# EAGLE design Buffer_Board (EAGLE 5.10)
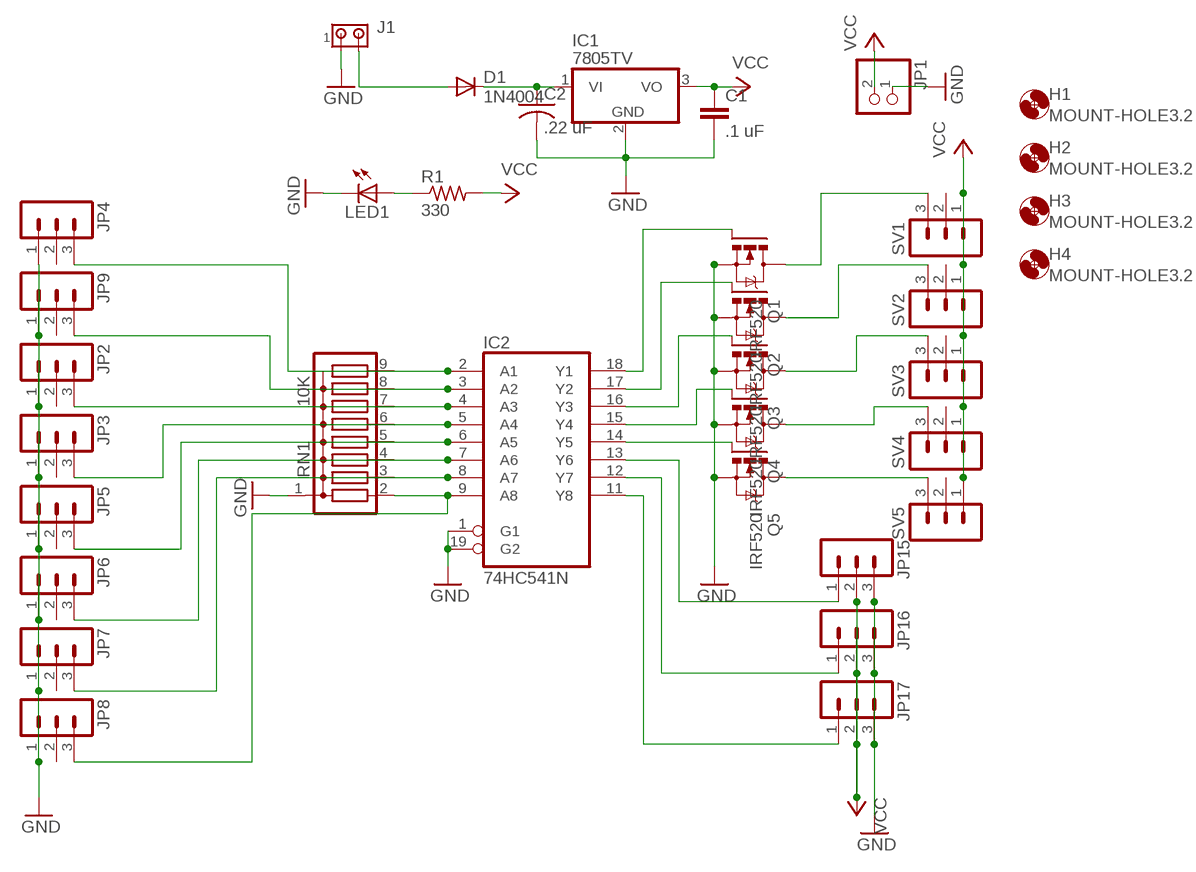
[diagram p0: schematic, sheet 1]

## Parts
C1  .1 uF  C2.5/2  [C2.5-2]
C2  .22 uF  C-US050-030X075  [C050-030X075]
D1  1N4004  [DO41-10]
H1  MOUNT-HOLE3.2  [3,2]
H2  MOUNT-HOLE3.2  [3,2]
H3  MOUNT-HOLE3.2  [3,2]
H4  MOUNT-HOLE3.2  [3,2]
IC1  7805TV  [TO220V]
IC2  74HC541N  [DIL20]
J1  MTA02-156  [1X2MTA]
JP1  PINHD-1X2  [1X02]
JP2  MA03-1  [MA03-1]
JP3  MA03-1  [MA03-1]
JP4  MA03-1  [MA03-1]
JP5  MA03-1  [MA03-1]
JP6  MA03-1  [MA03-1]
JP7  MA03-1  [MA03-1]
JP8  MA03-1  [MA03-1]
JP9  MA03-1  [MA03-1]
JP15  MA03-1  [MA03-1]
JP16  MA03-1  [MA03-1]
JP17  MA03-1  [MA03-1]
LED1  LED3MM  [LED3MM]
Q1  IRF520  [TO220BV]
Q2  IRF520  [TO220BV]
Q3  IRF520  [TO220BV]
Q4  IRF520  [TO220BV]
Q5  IRF520  [TO220BV]
R1  330  R-US_0207/10  [0207/10]
RN1  10K  G08R  [SIL9]
SV1  MA03-1  [MA03-1]
SV2  MA03-1  [MA03-1]
SV3  MA03-1  [MA03-1]
SV4  MA03-1  [MA03-1]
SV5  MA03-1  [MA03-1]

## Nets
GND: C1.2 C2.2 IC1.2(GND) IC2.1(G1) IC2.19(G2) J1.1 JP1.1 JP2.1 JP3.1 JP4.1 JP5.1 JP6.1 JP7.1 JP8.1 JP9.1 JP15.3 JP16.3 JP17.3 LED1.K(C) Q1.S Q2.S Q3.S Q4.S Q5.S RN1.1
N$1: C2.1 D1.C IC1.1(VI)
N$2: LED1.A R1.1
N$3: D1.A J1.2
N$4: IC2.13(Y6) JP15.1
N$5: Q5.D SV5.3
N$6: IC2.12(Y7) JP16.1
N$8: IC2.14(Y5) Q5.G
N$10: IC2.11(Y8) JP17.1
N$11: IC2.6(A5) JP5.3 RN1.5
N$12: IC2.7(A6) JP6.3 RN1.4
N$13: IC2.8(A7) JP7.3 RN1.3
N$14: IC2.9(A8) JP8.3 RN1.2
N$15: IC2.3(A2) JP9.3 RN1.8
N$16: IC2.2(A1) JP4.3 RN1.9
N$18: IC2.18(Y1) Q1.G
N$19: IC2.17(Y2) Q2.G
N$20: IC2.16(Y3) Q3.G
N$21: IC2.15(Y4) Q4.G
N$24: IC2.4(A3) JP2.3 RN1.7
N$26: Q1.D SV1.3
N$29: Q2.D SV2.3
N$30: Q3.D SV3.3
N$31: Q4.D SV4.3
N$32: IC2.5(A4) JP3.3 RN1.6
VCC: C1.1 IC1.3(VO) JP1.2 JP15.2 JP16.2 JP17.2 R1.2 SV1.1 SV2.1 SV3.1 SV4.1 SV5.1
Unconnected: JP2.2 JP3.2 JP4.2 JP5.2 JP6.2 JP7.2 JP8.2 JP9.2 SV1.2 SV2.2 SV3.2 SV4.2 SV5.2

## Power pins joined to a net without a drawn wire
GND: IC2.10(GND)
VCC: IC2.20(VCC)

## Library data of the parts
C1 = capacitor-wima:C: CAPACITOR naming: grid - package width
C2 = rcl:C-US: CAPACITOR, American symbol
D1 = diode:1N4004: DIODE general purpose rectifier, 1 A
H1-H4 = holes:MOUNT-HOLE: MOUNTING HOLE with drill center marker
IC1 = linear:78*: Positive VOLTAGE REGULATOR Source: http://cache.national.com/ds/LM/LM78L05.pdf http://www.fairchildsemi.com/ds/LM/LM7805.pdf
IC2 = 74xx-eu:74*541: Octal BUFFER and LINE DRIVER, 3-state
J1 = con-amp:MTA02-156: AMP connector
JP1 = pinhead:PINHD-1X2: PIN HEADER
JP2-JP9 JP15-JP17 SV1-SV5 = con-lstb:MA03-1: PIN HEADER
LED1 = led:LED: LED OSRAM: - CHIPLED LG R971, LG N971, LY N971, LG Q971, LY Q971, LO R971, LY R971 LH N974, LH R974 LS Q976, LO Q976, LY Q976 LO Q996 - Hyper CHIPLED LW Q18S LB Q993, LB Q99A, LB R99A - SideLED LS A670, LO A670, LY A670, LG A670, LP A670 LB A673, LV A673, LT A673, LW A673 LH A674 LY A675 LS A676, LA A676, LO A676, LY A676, LW A676 LS A679, LY A679, LG A679 - Hyper Micro SIDELED® LS Y876, LA Y876, LO Y876, LY Y876 LT Y87S - SmartLED LW L88C, LW L88S LB L89C, LB L89S, LG L890 LS L89K, LO L89K, LY L89K LS L896, LA L896, LO L896, LY L896 - TOPLED LS T670, LO T670, LY T670, LG T670, LP T670 LSG T670, LSP T670, LSY T670, LOP T670, LYG T670 LG T671, LOG T671, LSG T671 LB T673, LV T673, LT T673, LW T673 LH T674 LS T676, LA T676, LO T676, LY T676, LB T676, LH T676, LSB T676, LW T676 LB T67C, LV T67C, LT T67C, LS T67K, LO T67K, LY T67K, LW E67C LS E67B, LA E67B, LO E67B, LY E67B, LB E67C, LV E67C, LT E67C LW T67C LS T679, LY T679, LG T679 LS T770, LO T770, LY T770, LG T770, LP T770 LB T773, LV T773, LT T773, LW T773 LH T774 LS E675, LA E675, LY E675, LS T675 LS T776, LA T776, LO T776, LY T776, LB T776 LHGB T686 LT T68C, LB T68C - Hyper Mini TOPLED® LB M676 - Mini TOPLED Santana® LG M470 LS M47K, LO M47K, LY M47K Source: http://www.osram.convergy.de LUXEON: - LUMILED® LXK2-PW12-R00, LXK2-PW12-S00, LXK2-PW14-U00, LXK2-PW14-V00 LXK2-PM12-R00, LXK2-PM12-S00, LXK2-PM14-U00 LXK2-PE12-Q00, LXK2-PE12-R00, LXK2-PE12-S00, LXK2-PE14-T00, LXK2-PE14-U00 LXK2-PB12-K00, LXK2-PB12-L00, LXK2-PB12-M00, LXK2-PB14-N00, LXK2-PB14-P00, LXK2-PB14-Q00 LXK2-PR12-L00, LXK2-PR12-M00, LXK2-PR14-Q00, LXK2-PR14-R00 LXK2-PD12-Q00, LXK2-PD12-R00, LXK2-PD12-S00 LXK2-PH12-R00, LXK2-PH12-S00 LXK2-PL12-P00, LXK2-PL12-Q00, LXK2-PL12-R00 Source: www.luxeon.com KINGBRIGHT: KA-3528ASYC Source: www.kingbright.com
Q1-Q5 = transistor-power:IRF520: HEXFET Power MOSFET
R1 = rcl:R-US_: RESISTOR, American symbol
RN1 = resistor-sil:G08R: SIL RESISTOR

## Board
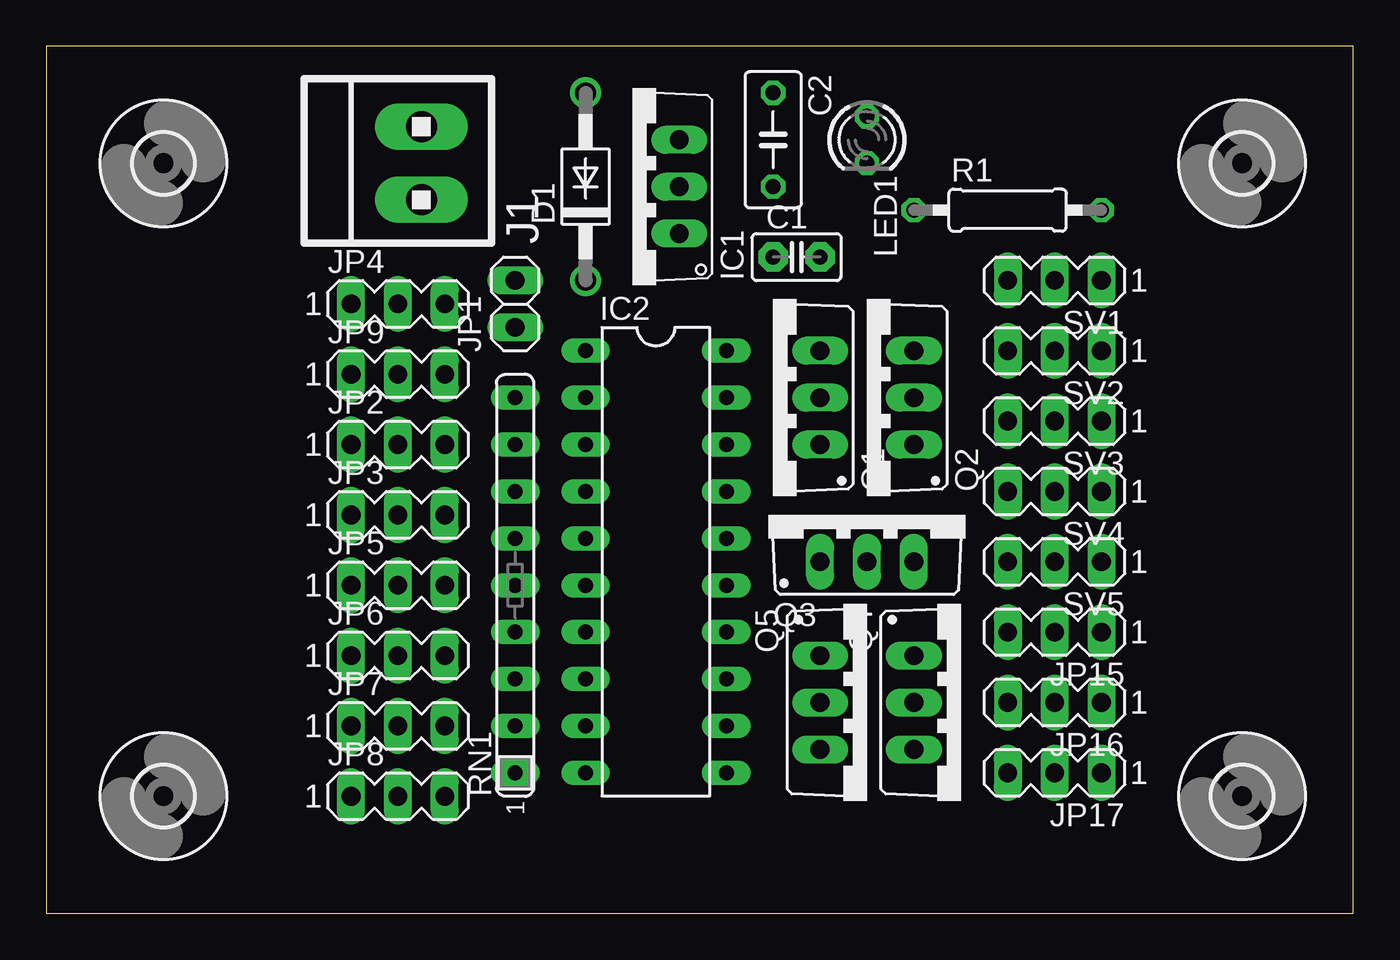
[diagram p1: board, top side]
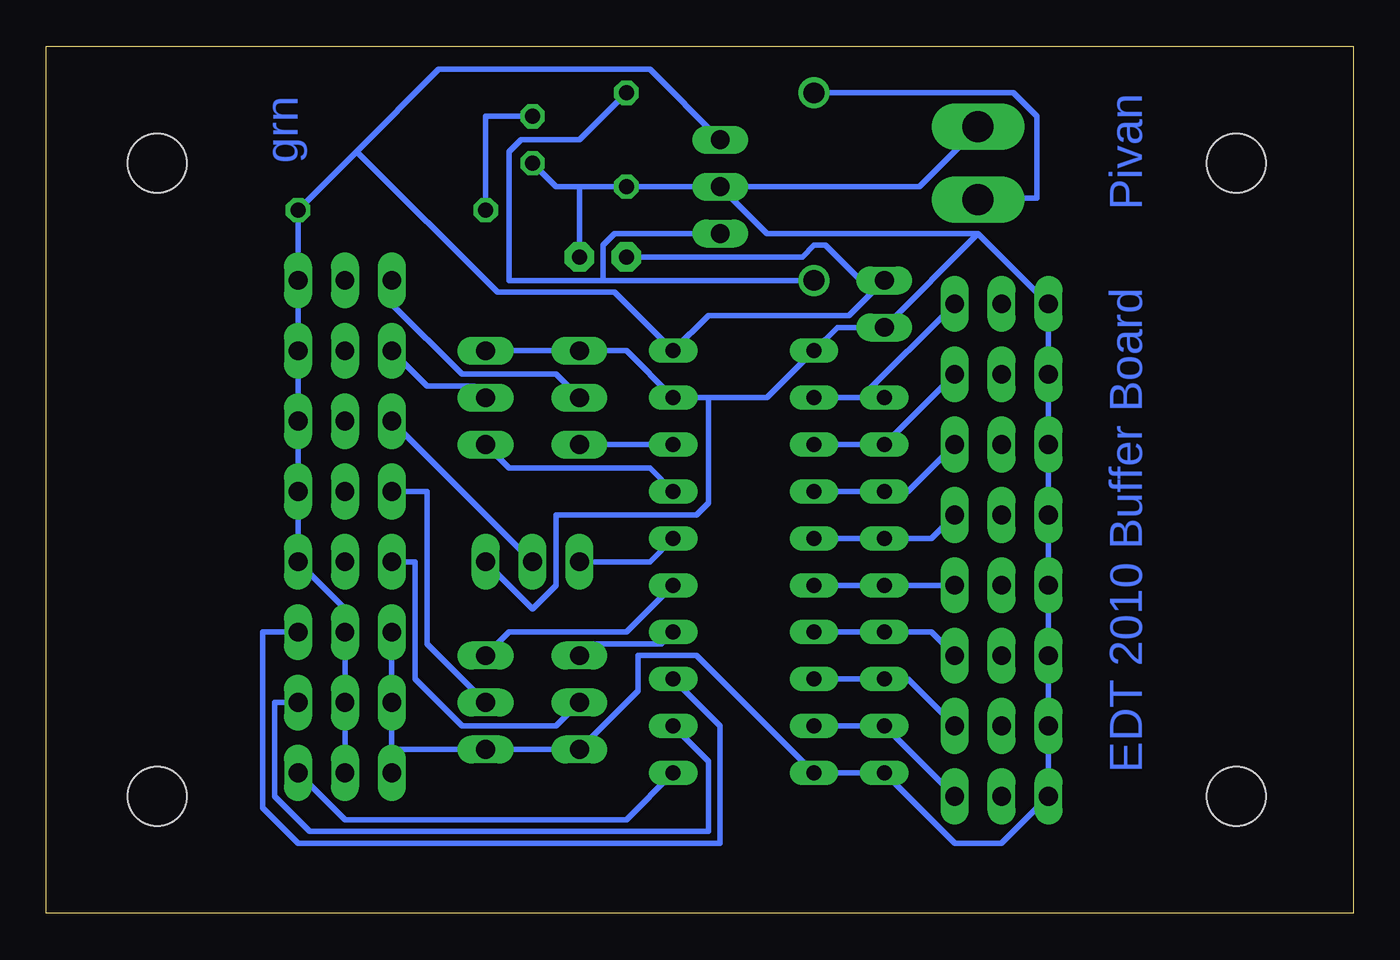
[diagram p2: board, bottom side, seen from below]

Size 70.79 x 46.98 mm. Coordinates in mm from the lower left corner, seen from the top.
Outline: 0,0 70.79,0 70.79,46.98 0,46.98 0,0
Copper layers (1*16): Top 0.035mm / dielectric 1.5mm / Bottom 0.035mm
Design rules "default *": minimum track width 12mil, minimum drill 24mil, track to track 12mil, track to pad 12mil, pad to pad 12mil, via to via 12mil, smd to smd 12mil, copper to edge 40mil, drill to drill 8mil, minimum pad ring 10mil, minimum via ring 8mil, stop-mask expansion 4mil, vias tented up to drill 0mil, thermal gap 10mil

### Footprints (pad centres in the part's own frame; a part is rotated, then mirrored left to right if it is on the bottom)
C2.5-2 = drill 0.813 pad 1.6 octagon: 1 -1.27,0; 2 1.27,0
C050-030X075 = drill 0.813 octagon: 1 -2.54,0; 2 2.54,0
DO41-10 = drill 1.118 round: A 5.08,0; C -5.08,0
3,2 = hole 3.2: 0,0
TO220V = drill 1.016 long: 1 -2.54,-2.54; 2 0,-2.54; 3 2.54,-2.54
DIL20 = drill 0.813 long: 1 -11.43,-3.81; 2 -8.89,-3.81; 3 -6.35,-3.81; 4 -3.81,-3.81; 5 -1.27,-3.81; 6 1.27,-3.81; 7 3.81,-3.81; 8 6.35,-3.81; 9 8.89,-3.81; 10 11.43,-3.81; 11 11.43,3.81; 12 8.89,3.81; 13 6.35,3.81; 14 3.81,3.81; 15 1.27,3.81; 16 -1.27,3.81; 17 -3.81,3.81; 18 -6.35,3.81; 19 -8.89,3.81; 20 -11.43,3.81
1X2MTA = drill 1.676 long: 1 1.981,0; 2 -1.981,0
1X02 = drill 1.016 long: 1 -1.27,0; 2 1.27,0
MA03-1 = drill 1.016 long: 1 -2.54,0; 2 0,0; 3 2.54,0
LED3MM = drill 0.813 octagon: A -1.27,0; K 1.27,0
TO220BV = drill 1.016 long: D 0,-2.54; G -2.54,-2.54; S 2.54,-2.54
0207/10 = drill 0.813 octagon: 1 -5.08,0; 2 5.08,0
SIL9 = drill 0.813 long: 1 -10.16,0; 2 -7.62,0; 3 -5.08,0; 4 -2.54,0; 5 0,0; 6 2.54,0; 7 5.08,0; 8 7.62,0; 9 10.16,0

### Placement (x,y rotation side)
C1  40.64,35.56 0 top
C2  39.37,41.91 270 top
D1  29.21,39.37 90 top
H1  6.35,40.64 0 top
H2  64.77,40.64 0 top
H3  64.77,6.35 0 top
H4  6.35,6.35 0 top
IC1  31.75,39.37 90 top
IC2  33.02,19.05 270 top
J1  20.32,40.64 90 top
JP1  25.4,33.02 90 top
JP2  19.05,25.4 0 top
JP3  19.05,21.59 0 top
JP4  19.05,33.02 0 top
JP5  19.05,17.78 0 top
JP6  19.05,13.97 0 top
JP7  19.05,10.16 0 top
JP8  19.05,6.35 0 top
JP9  19.05,29.21 0 top
JP15  54.61,15.24 180 top
JP16  54.61,11.43 180 top
JP17  54.61,7.62 180 top
LED1  44.45,41.91 270 top
Q1  39.37,27.94 90 top
Q2  44.45,27.94 90 top
Q3  44.45,21.59 0 top
Q4  49.53,11.43 270 top
Q5  44.45,11.43 270 top
R1  52.07,38.1 0 top
RN1  25.4,17.78 90 top
SV1  54.61,34.29 180 top
SV2  54.61,30.48 180 top
SV3  54.61,26.67 180 top
SV4  54.61,22.86 180 top
SV5  54.61,19.05 180 top

### Tracks (layer width: path | path; a pad name or v marks a point on that pad's centre or on a via)
GND
  Bottom 0.305: Q3.S 44.45,16.51 43.18,17.78 43.18,21.59 35.56,21.59 34.93,22.23 34.93,27.94 | 34.93,27.94 IC2.19 39.37,30.48 Q1.S Q2.S | 34.93,27.94 31.75,27.94 IC2.1 27.94,31.75 JP1.1 20.32,36.83 | IC1.2 C2.2 41.91,39.37 | LED1.K 43.18,39.37 41.91,39.37 | 41.91,39.37 C1.2 | IC1.2 23.5,39.37 20.32,42.55 J1.1 | 52.07,8.89 JP16.3 JP15.3 | 52.07,8.89 Q4.S Q5.S 38.74,12.06 38.74,13.97 35.56,13.97 IC2.10 RN1.1 21.59,3.81 19.05,3.81 JP8.1 JP7.1 JP6.1 JP5.1 JP3.1 JP2.1 JP9.1 JP4.1 20.32,36.83 | 52.07,8.89 JP17.3 | IC1.2 31.75,36.83 20.32,36.83
N$1
  Bottom 0.305: C2.1 41.91,41.91 45.09,41.91 45.72,41.27 45.72,34.29 40.64,34.29 | D1.C 40.64,34.29 | IC1.1 40.01,36.83 40.64,36.2 40.64,34.29
N$2
  Bottom 0.305: R1.1 46.99,43.18 LED1.A
N$3
  Bottom 0.305: D1.A 18.41,44.45 17.14,43.18 17.14,38.73 20.32,38.73 J1.2
N$4
  Bottom 0.305: IC2.13 34.29,10.16 34.29,3.81 57.15,3.81 59.05,5.71 59.05,15.24 JP15.1
N$5
  Bottom 0.305: Q5.D 43.18,10.16 48.26,10.16 50.8,12.7 50.8,19.05 SV5.3
N$6
  Bottom 0.305: IC2.12 34.93,8.26 34.93,4.44 56.52,4.44 58.42,6.35 58.42,11.43 JP16.1
N$8
  Bottom 0.305: IC2.14 37.47,14.6 41.28,14.6 Q5.G
N$10
  Bottom 0.305: IC2.11 39.37,5.08 54.61,5.08 JP17.1
N$11
  Bottom 0.305: JP5.3 RN1.5 IC2.6
N$12
  Bottom 0.305: IC2.7 RN1.4 22.86,15.24 JP6.3
N$13
  Bottom 0.305: IC2.8 RN1.3 24.13,12.7 JP7.3
N$14
  Bottom 0.305: IC2.9 RN1.2 JP8.3
N$15
  Bottom 0.305: IC2.3 RN1.8 JP9.3
N$16
  Bottom 0.305: 26.67,27.94 IC2.2 | 26.67,27.94 JP4.3 | RN1.9 26.67,27.94
N$18
  Bottom 0.305: IC2.18 Q1.G
N$19
  Bottom 0.305: IC2.17 38.1,24.13 45.72,24.13 Q2.G
N$20
  Bottom 0.305: IC2.16 38.1,19.05 Q3.G
N$21
  Bottom 0.305: IC2.15 39.37,15.24 45.72,15.24 Q4.G
N$24
  Bottom 0.305: IC2.4 RN1.7 24.13,22.86 JP2.3
N$26
  Bottom 0.305: Q1.D 43.18,29.21 48.26,29.21 52.07,33.02 SV1.3
N$29
  Bottom 0.305: Q2.D 47.62,28.58 50.17,28.58 SV2.3
N$30
  Bottom 0.305: Q3.D SV3.3
N$31
  Bottom 0.305: Q4.D 50.17,14.6 50.17,22.86 SV4.3
N$32
  Bottom 0.305: IC2.5 RN1.6 22.86,20.32 JP3.3
VCC
  Bottom 0.305: JP17.2 JP16.2 JP15.2 54.61,16.51 SV5.1 SV4.1 SV3.1 SV2.1 SV1.1 R1.2 53.98,41.27 | 26.04,33.66 27.3,32.38 34.93,32.38 IC2.20 40.01,33.66 46.36,33.66 53.98,41.27 | C1.1 29.84,35.56 29.21,36.2 28.57,36.2 26.04,33.66 | 26.04,33.66 JP1.2 | IC1.3 38.1,45.72 49.53,45.72 53.98,41.27

### Text on the board
Bottom: grn | Pivan | EDT 2010 Buffer Board